# EAGLE design controller-rev1.1 (EAGLE 9.6.2)
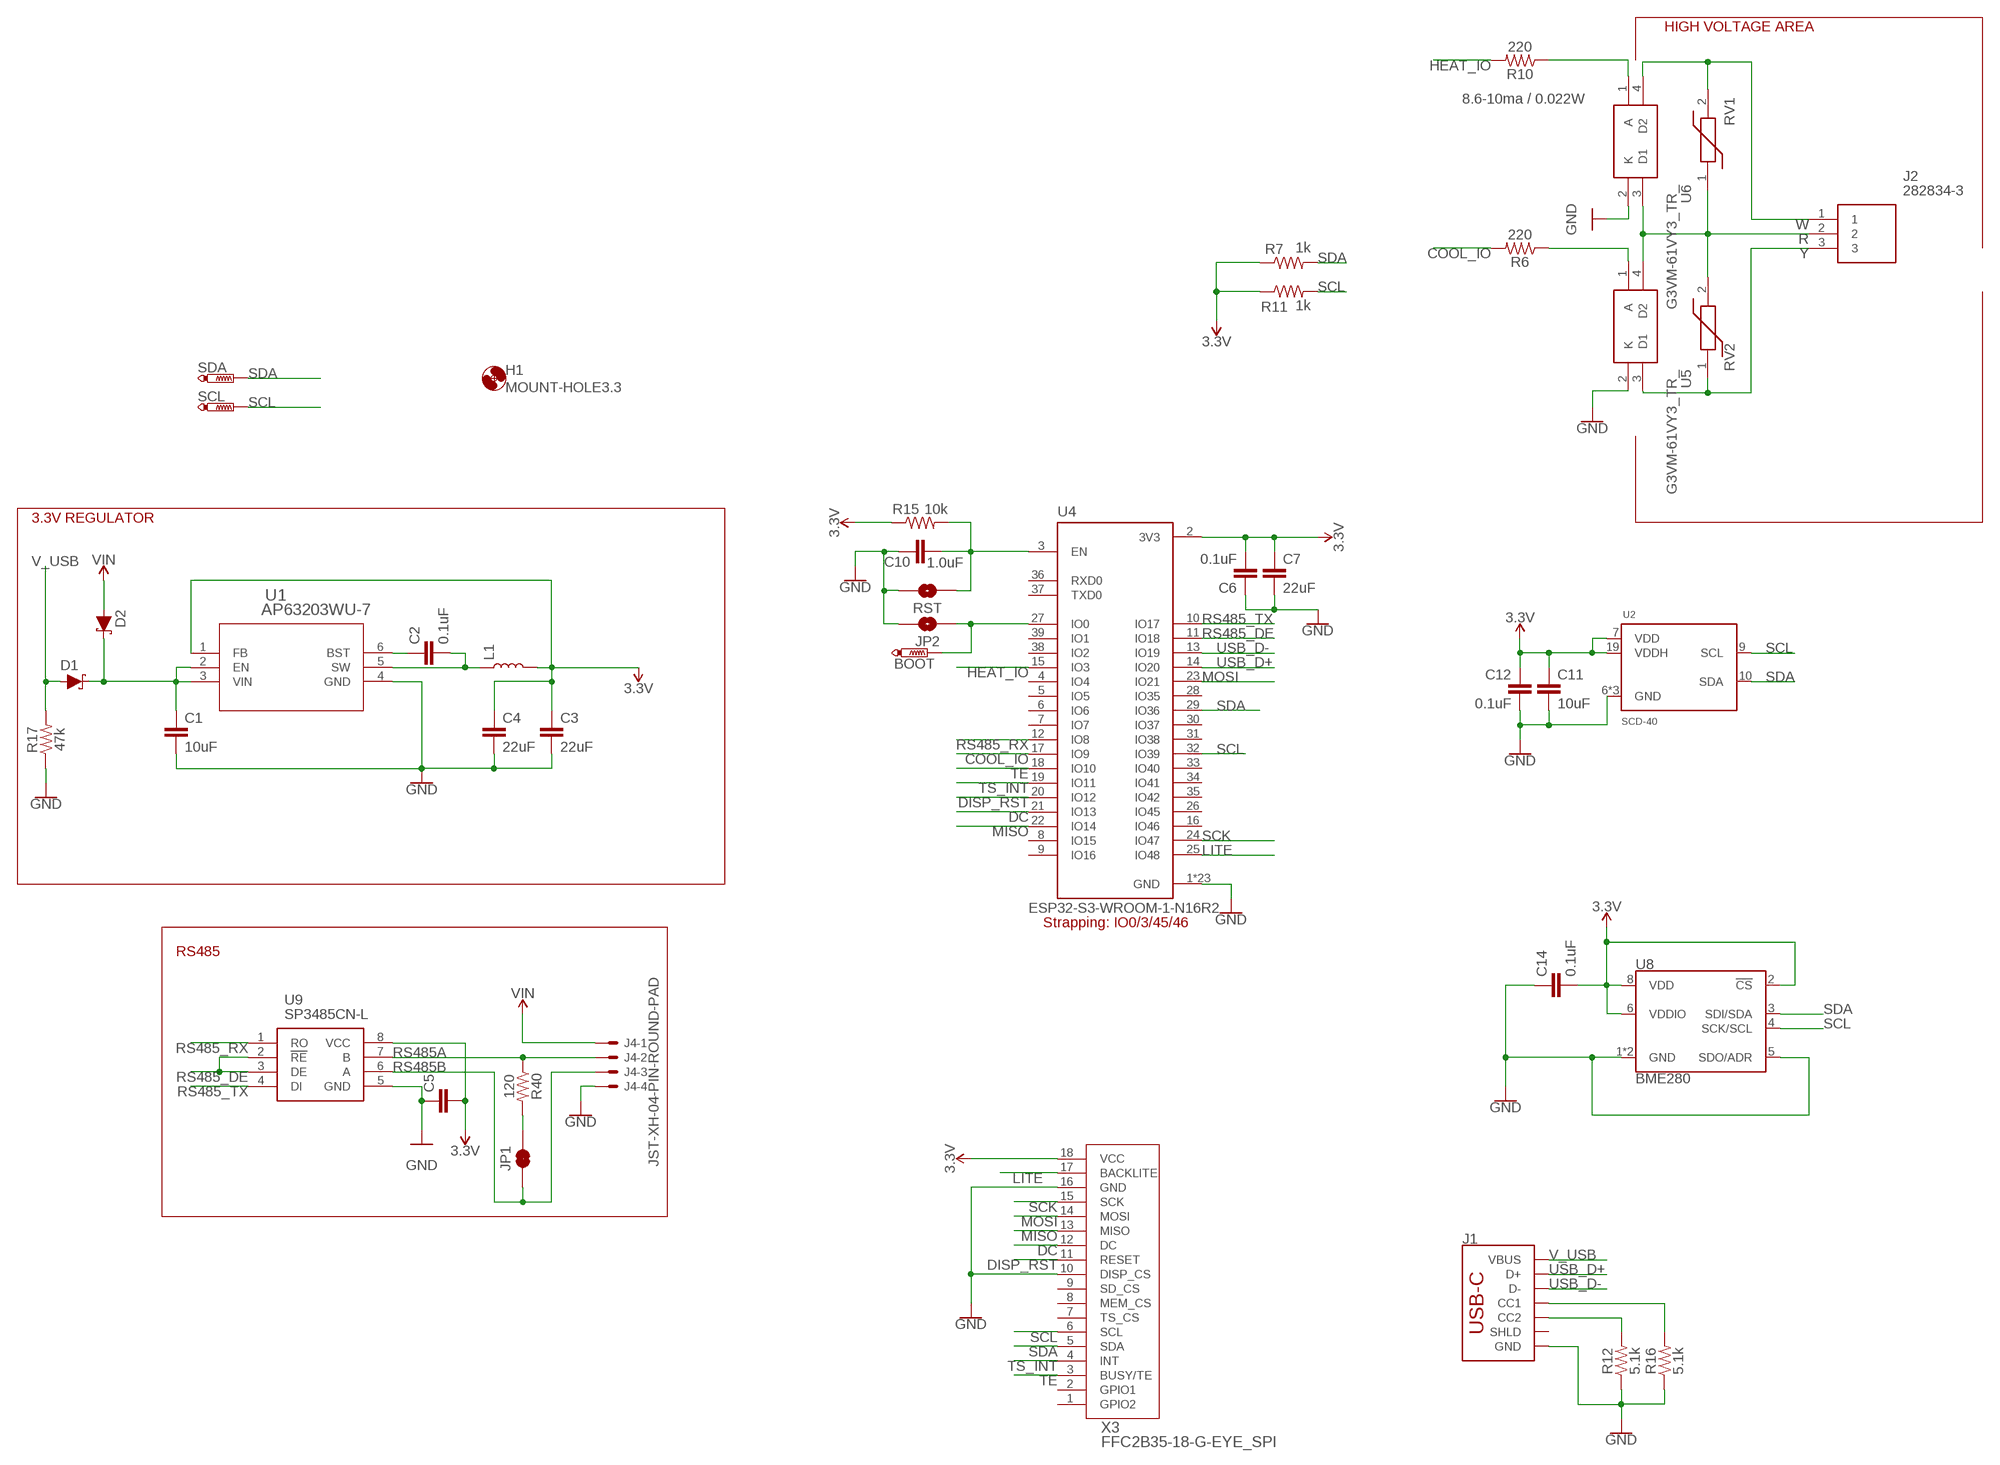
[diagram p0: schematic, sheet 1]

## Parts
BOOT  PTR1B1,27  [B1,27]
C1  10uF  10UF-1206-6.3V-20%  [1206]
C2  0.1uF  0.1UF-0603-25V-5%  [0603]
C3  22uF  22UF-0805-6.3V-20%  [0805]
C4  22uF  22UF-0805-6.3V-20%  [0805]
C5  0.1uF  0.1UF-0603-25V-5%  [0603]
C6  0.1uF  0.1UF-0603-25V-5%  [0603]
C7  22uF  22UF-0805-6.3V-20%  [0805]
C10  1.0uF  1.0UF-0603-16V-10%  [0603]
C11  10uF  10UF-1206-6.3V-20%  [1206]
C12  0.1uF  0.1UF-0603-25V-5%  [0603]
C14  0.1uF  0.1UF-0603-25V-5%  [0603]
D1  1A/23V/620mV  DIODE-SCHOTTKY-BAT20J  [SOD-323]
D2  1A/23V/620mV  DIODE-SCHOTTKY-BAT20J  [SOD-323]
H1  MOUNT-HOLE3.3  [3,3]
J1  USB_C_2-LAYER_PADS  [USB-C-16P-2LAYER-PADS]
J2  282834-3  [2828343]
J4  JST-XH-04-PIN-ROUND-PAD  [JST-XH-04-PACKAGE-ROUND-PAD]
JP1  JUMPER-SMT_2_NC_TRACE_NO-SILK  [SMT-JUMPER_2_NC_TRACE_NO-SILK]
JP2  JUMPER-SMT_2_NO_NO-SILK  [SMT-JUMPER_2_NO_NO-SILK]
L1  4.7μH_SHIELDED_INDUCTOR  [1008(2520)]
R6  220  220OHM-0603-1/10W-1%  [0603]
R7  1k  1KOHM-0603-1/10W-1%  [0603]
R10  220  220OHM-0603-1/10W-1%  [0603]
R11  1k  1KOHM-0603-1/10W-1%  [0603]
R12  5.1k  5.1KOHM5.1KOHM-0603-1/10W-1%  [0603]
R15  10k  10KOHM-0603-1/10W-1%  [0603]
R16  5.1k  5.1KOHM5.1KOHM-0603-1/10W-1%  [0603]
R17  47k  47KOHM-0603-1/10W-1%  [0603]
R40  120  120OHM-0603-1/10W-5%  [0603]
RST  JUMPER-SMT_2_NO_NO-SILK  [SMT-JUMPER_2_NO_NO-SILK]
RV1  ZV35K1210251NIR1  [VARC3225X145N]
RV2  ZV35K1210251NIR1  [VARC3225X145N]
SCL  PTR1B1,27  [B1,27]
SDA  PTR1B1,27  [B1,27]
U1  AP63203WU-7  [SOIC_05WU-7_DIO]
U2  SCD-40  [SCD40]
U4  ESP32-S3-WROOM-1-N16R2  [XCVR_ESP32-S3-WROOM-1-N16R2]
U5  G3VM-61VY3_TR_  [G3VM61VY3TR]
U6  G3VM-61VY3_TR_  [G3VM61VY3TR]
U8  BME280  [LGA-8-2.5X2.5]
U9  SP3485CN-L  [SOIC127P600X175-8N]
X3  FFC2B35-18-G-EYE_SPI  [FFC2B3518G]

## Nets
3.3V: C3.1 C4.1 C5.2 C6.2 C7.1 C11.1 C12.2 C14.2 L1.2 R7.1 R11.1 R15.1 U1.1(FB) U2.7(VDD) U2.19(VDDH) U4.2(3V3) U8.2(!CS) U8.6(VDDIO) U8.8(VDD) U9.8(VCC) X3.18(VCC)
COOL_IO: R6.2 U4.17(IO9)
DC: U4.21(IO13) X3.12(DC)
DISP_RST: U4.20(IO12) X3.11(RESET)
GND: C1.2 C3.2 C4.2 C5.1 C6.1 C7.2 C10.1 C11.2 C12.1 C14.1 J1.GND J1.GND2(GND) J4.4 JP2.2 R12.1 R16.1 R17.1 RST.2 U1.4(GND) U2.6(GND) U2.20(GND) U2.P$1(GND) U4.1(GND) U4.40(GND) U4.41_1(GND) U4.41_2(GND) U4.41_3(GND) U4.41_4(GND) U4.41_5(GND) U4.41_6(GND) U4.41_7(GND) U4.41_8(GND) U4.41_9(GND) U4.41_10(GND) U4.41_11(GND) U4.41_12(GND) U4.41_13(GND) U4.41_14(GND) U4.41_15(GND) U4.41_16(GND) U4.41_17(GND) U4.41_18(GND) U4.41_19(GND) U4.41_20(GND) U4.41_21(GND) U5.2(K) U6.2(K) U8.1(GND) U8.5(SDO/ADR) U8.7(GND) U9.5(GND) X3.10(DISP_CS) X3.16(GND)
HEAT_IO: R10.2 U4.15(IO3)
LITE: U4.25(IO48) X3.17(BACKLITE)
MISO: U4.22(IO14) X3.13(MISO)
MOSI: U4.23(IO21) X3.14(MOSI)
N$1: C2.2 L1.1 U1.5(SW)
N$2: C2.1 U1.6(BST)
N$3: BOOT.TP JP2.1 U4.27(IO0)
N$4: R6.1 U5.1(A)
N$5: JP1.2 R40.2
N$7: J1.A5(CC1) R16.2
N$9: C10.2 R15.2 RST.1 U4.3(EN)
N$10: R10.1 U6.1(A)
N$14: J1.B5(CC2) R12.2
R: J2.2 RV1.1 RV2.2 U5.4(D2) U6.3(D1)
REG_IN: C1.1 D1.C D2.C U1.2(EN) U1.3(VIN)
RS485_DE: U4.11(IO18) U9.2(!RE) U9.3(DE)
RS485_RX: U4.12(IO8) U9.1(RO)
RS485_TX: U4.10(IO17) U9.4(DI)
RS485A: J4.2 R40.1 U9.7(B)
RS485B: J4.3 JP1.1 U9.6(A)
SCK: U4.24(IO47) X3.15(SCK)
SCL: R11.2 SCL.TP U2.9(SCL) U4.32(IO39) U8.4(SCK/SCL) X3.6(SCL)
SDA: R7.2 SDA.TP U2.10(SDA) U4.29(IO36) U8.3(SDI/SDA) X3.5(SDA)
TE: U4.18(IO10) X3.3(BUSY/TE)
TS_INT: U4.19(IO11) X3.4(INT)
USB_D+: J1.A6(D+) J1.B6(D+) U4.14(IO20)
USB_D-: J1.A7(D-) J1.B7(D-) U4.13(IO19)
V_USB: D1.A J1.VBUS1(VBUS) J1.VBUS2(VBUS) R17.2
VIN: D2.A J4.1
W: J2.1 RV1.2 U6.4(D2)
Y: J2.3 RV2.1 U5.3(D1)
Unconnected: J1.SHLD1(SHLD) J1.SHLD2(SHLD) J1.SHLD3(SHLD) J1.SHLD4(SHLD) U4.4(IO4) U4.5(IO5) U4.6(IO6) U4.7(IO7) U4.8(IO15) U4.9(IO16) U4.16(IO46) U4.26(IO45) U4.28(IO35) U4.30(IO37) U4.31(IO38) U4.33(IO40) U4.34(IO41) U4.35(IO42) U4.36(RXD0) U4.37(TXD0) U4.38(IO2) U4.39(IO1) X3.1(GPIO2) X3.2(GPIO1) X3.7(TS_CS) X3.8(MEM_CS) X3.9(SD_CS)

## Notes on the sheet
- HIGH VOLTAGE AREA
- 8.6-10ma / 0.022W
- 3.3V REGULATOR
- Strapping: IO0/3/45/46
- RS485

## Library data of the parts
BOOT SCL SDA = testpad:PTR1: TEST PIN
C1 C11 = SparkFun-Capacitors:10UF: 10.0µF ceramic capacitors A capacitor is a passive two-terminal electrical component used to store electrical energy temporarily in an electric field.; PROD_ID: CAP-10057
C2 C5 C6 C12 C14 = SparkFun-Capacitors:0.1UF: 0.1µF ceramic capacitors A capacitor is a passive two-terminal electrical component used to store electrical energy temporarily in an electric field.; PROD_ID: CAP-08604
C3 C4 C7 = SparkFun-Capacitors:22UF: 22µF ceramic capacitors A capacitor is a passive two-terminal electrical component used to store electrical energy temporarily in an electric field.; PROD_ID: CAP-08402
C10 = SparkFun-Capacitors:1.0UF: 1µF ceramic capacitors A capacitor is a passive two-terminal electrical component used to store electrical energy temporarily in an electric field.; PROD_ID: CAP-00868
D1 D2 = SparkFun-DiscreteSemi:DIODE-SCHOTTKY: Schottky diode A Schottky diode is a semiconductor diode which has a low forward voltage drop and a very fast switching action.; PROD_ID: DIO-11623
H1 = holes:MOUNT-HOLE: MOUNTING HOLE with drill center marker
J1 = SparkFun-Connectors:USB_C: USB Type C 16Pin Connector Super Speed pins not available on the 16-pin purely SMD connector so this part is best for USB 2.0 implementations. D1 and D2 are tied together enabling D+/- no matter which way the cable is plugged into the connector. The two channel configuration pins (CC1/2) are exposed. These are normally connected to ground via 5.1k resistors but can be reconfigured for high current/high power applications. **4-LAYER BOARD WARNING!!** If designing 4-layer board, make sure to select the variant _4-LAYER-ISOLATED. The linked footprint (USB-C-16-4LAYER-ISOLATED) includes some very necessary cutout polygons in the inner layers (2 and 15). This prevents the PTH mounting shield legs on the USB connector from electrically connecting any other polygons on the inner layers (usually VCC and GND).; PROD_ID: CONN-14122
J2 = TE terminal block 282834-3:282834-3: Connector pcb 3 way 2.54mm Termi-Block Source: Datasheet <https://www.te.com/commerce/DocumentDelivery/DDEController?Action=showdoc&DocId=Customer Drawing282834C1pdfEnglishENG_CD_282834_C1.pdf282834-3>; DESCRIPTION: Connector pcb 3 way 2.54mm Termi-Block; HEIGHT: 10mm; MANUFACTURER_NAME: TE Connectivity; MANUFACTURER_PART_NUMBER: 282834-3; MOUSER_PART_NUMBER: 571-2828343; MOUSER_PRICE-STOCK: https://www.mouser.co.uk/ProductDetail/TE-Connectivity/282834-3?qs=A%252Bip%252BNCYi6M69kAjqV38yA%3D%3D
J4 = Rembrandt Electronics - JST XH Connectors v1-0:JST-XH-04-PIN: JST XH Connector 2 Pin Wire to board connector. Pitch: 2,54 mm, (0.100") Number of pins: 4 Created by Rembrandt Electronics www.rembrandtelectronics.com
JP1 = SparkFun-Jumpers:JUMPER-SMT_2_NC_TRACE: Normally closed trace jumper This jumper has a trace between two pads so it's normally closed (NC). Use a razor knife to open the connection. For best results follow the IPC guidelines for cutting traces: Cutout at least 0.063 mm (0.005 in). Remove all loose material to clean up the cut area. Seal the cut with an approved epoxy. Reapply solder to reclose the connection.
JP2 RST = SparkFun-Jumpers:JUMPER-SMT_2_NO: Normally open jumper This jumper has two pads in close proximity to each other. Apply solder to close the connection. Round pads are easier to solder for beginners, but are a lot larger. SparkFun Product that uses the round pads: SparkFun EL Sequencer <https://www.sparkfun.com/products/12781>
L1 = SparkFun-Coils:4.7μH_SHIELDED_INDUCTOR: 4.7uH Inductor 4.7uH 1.4A 50mOhm 1008(2520) Package Shielded; PROD_ID: NDUC-14880
R6 R10 = SparkFun-Resistors:220OHM: 220Ω resistor A resistor is a passive two-terminal electrical component that implements electrical resistance as a circuit element. Resistors act to reduce current flow, and, at the same time, act to lower voltage levels within circuits. - Wikipedia; PROD_ID: RES-07861
R7 R11 = SparkFun-Resistors:1KOHM: 1kΩ resistor A resistor is a passive two-terminal electrical component that implements electrical resistance as a circuit element. Resistors act to reduce current flow, and, at the same time, act to lower voltage levels within circuits. - Wikipedia; PROD_ID: RES-07856
R12 R16 = SparkFun-Resistors:5.1KOHM; PROD_ID: RES-12083
R15 = SparkFun-Resistors:10KOHM: 10kΩ resistor A resistor is a passive two-terminal electrical component that implements electrical resistance as a circuit element. Resistors act to reduce current flow, and, at the same time, act to lower voltage levels within circuits. - Wikipedia; PROD_ID: RES-00824
R17 = SparkFun-Resistors:47KOHM: 47kΩ resistor A resistor is a passive two-terminal electrical component that implements electrical resistance as a circuit element. Resistors act to reduce current flow, and, at the same time, act to lower voltage levels within circuits. - Wikipedia; PROD_ID: RES-07871
R40 = Resistors:120OHM
RV1 RV2 = Bourns Varistor ZV35K1210251NIR1:ZV35K1210251NIR1: Varistors ZV 35V 10% Source: Datasheet <https://g.componentsearchengine.com/Datasheets/2/ZV60K1210251NIR1HT.pdf>; DESCRIPTION: Varistors ZV 35V 10%; HEIGHT: 1.45mm; MANUFACTURER_NAME: Bourns; MANUFACTURER_PART_NUMBER: ZV35K1210251NIR1; MOUSER_PART_NUMBER: 652-ZV35K1210251NIR1; MOUSER_PRICE-STOCK: https://www.mouser.co.uk/ProductDetail/Bourns/ZV35K1210251NIR1?qs=GBLSl2AkirutxOaOmtSxyA%3D%3D
U1 = Diodes buck converter:AP63203WU-7; COPYRIGHT: Copyright (C) 2023 Ultra Librarian. All rights reserved.; MANUFACTURER_PART_NUMBER: AP63203WU-7; MFR_NAME: Diodes Inc
U2 = Adafruit SCD-41:SCD-40
U4 = ESP32-S3-WROOM-1-N16R2:ESP32-S3-WROOM-1-N16R2: Check availability <https://pricing.snapeda.com/parts/ESP32S3WROOM1N16R2/Espressif%20Systems/view-part?ref=eda>; AVAILABILITY: In Stock; CHECK_PRICES: https://www.snapeda.com/parts/ESP32S3WROOM1N16R2/Espressif+Systems/view-part/?ref=eda; DESCRIPTION: Bluetooth, WiFi 802.11b/g/n, Bluetooth v5.0 Transceiver Module 2.4GHz PCB Trace Surface Mount; MF: Espressif Systems; MP: ESP32S3WROOM1N16R2; PACKAGE: NON STANDARD Espressif Systems; PRICE: None; PURCHASE-URL: https://www.snapeda.com/api/url_track_click_mouser/?unipart_id=10874217&manufacturer=Espressif Systems&part_name=ESP32S3WROOM1N16R2&search_term=None; SNAPEDA_LINK: https://www.snapeda.com/parts/ESP32S3WROOM1N16R2/Espressif+Systems/view-part/?ref=snap
U5 U6 = Omron SSR G3VM-61VY3_TR_:G3VM-61VY3_TR_: Solid State Relays - PCB Mount MOSFET Relay SOP4 60V 700mA 1 Form A Source: Datasheet <https://www.arrow.com/en/products/g3vm-61vy3-tr/omron>; DESCRIPTION: Solid State Relays - PCB Mount MOSFET Relay SOP4 60V 700mA 1 Form A; HEIGHT: 2.5mm; MANUFACTURER_NAME: Omron Electronics; MANUFACTURER_PART_NUMBER: G3VM-61VY3(TR); MOUSER_PART_NUMBER: 653-G3VM-61VY3TR; MOUSER_PRICE-STOCK: https://www.mouser.co.uk/ProductDetail/Omron-Electronics/G3VM-61VY3TR?qs=F5EMLAvA7IDWDr%252BrEjvwmw%3D%3D
U8 = SparkFun-Sensors:BME280: Bosch BME280 – Combined Humidity and Pressure Sensor The BME280 is as combined digital humidity, pressure and temperature sensor based on proven sensing principles. The sensor module is housed in an extremely compact metal-lid LGA package with a footprint of only 2.5×2.5mm² with a height of 0.93mm. Its small dimensions and its low power consumption allow the implementation in battery driven devices such as handsets, GPS modules or watches. Datasheet <https://cdn.sparkfun.com/assets/learn_tutorials/4/1/9/BST-BME280_DS001-10.pdf> SparkFun Products SparkFun Atmospheric Sensor Breakout - BME280 <https://www.sparkfun.com/products/13676> (SEN-13676); PROD_ID: IC-13090
U9 = MaxLinear RS485 SP3485CN-L:SP3485CN-L: Transceiver RS-485 3.3V 10Mbps SOIC8 EXAR SP3485CN-L, Line Transceiver, RS-422, RS-485, 3.3 V, 8-Pin SOIC Source: Datasheet <https://componentsearchengine.com/Datasheets/1/SP3485CN-L.pdf>; DESCRIPTION: Transceiver RS-485 3.3V 10Mbps SOIC8 EXAR SP3485CN-L, Line Transceiver, RS-422, RS-485, 3.3 V, 8-Pin SOIC; HEIGHT: 1.75mm; MANUFACTURER_NAME: EXAR; MANUFACTURER_PART_NUMBER: SP3485CN-L; MOUSER_PART_NUMBER: 701-SP3485CN-L; MOUSER_PRICE-STOCK: https://www.mouser.com/Search/Refine.aspx?Keyword=701-SP3485CN-L
X3 = GCT FFC2B35-18-G:FFC2B35-18-G-EYE_SPI: FFC & FPC Connectors .5mm SideEntry Flat Flex Cbl Conn 18P Au Source: Datasheet; DESCRIPTION: FFC & FPC Connectors .5mm SideEntry Flat Flex Cbl Conn 18P Au; HEIGHT: 2.2mm; MANUFACTURER_NAME: GCT (GLOBAL CONNECTOR TECHNOLOGY); MANUFACTURER_PART_NUMBER: FFC2B35-18-G; MOUSER_PART_NUMBER: 640-FFC2B35-18-G; MOUSER_PRICE-STOCK: https://www.mouser.co.uk/ProductDetail/GCT/FFC2B35-18-G?qs=Li%252BoUPsLEntRHHb6c10PFg%3D%3D

## Board
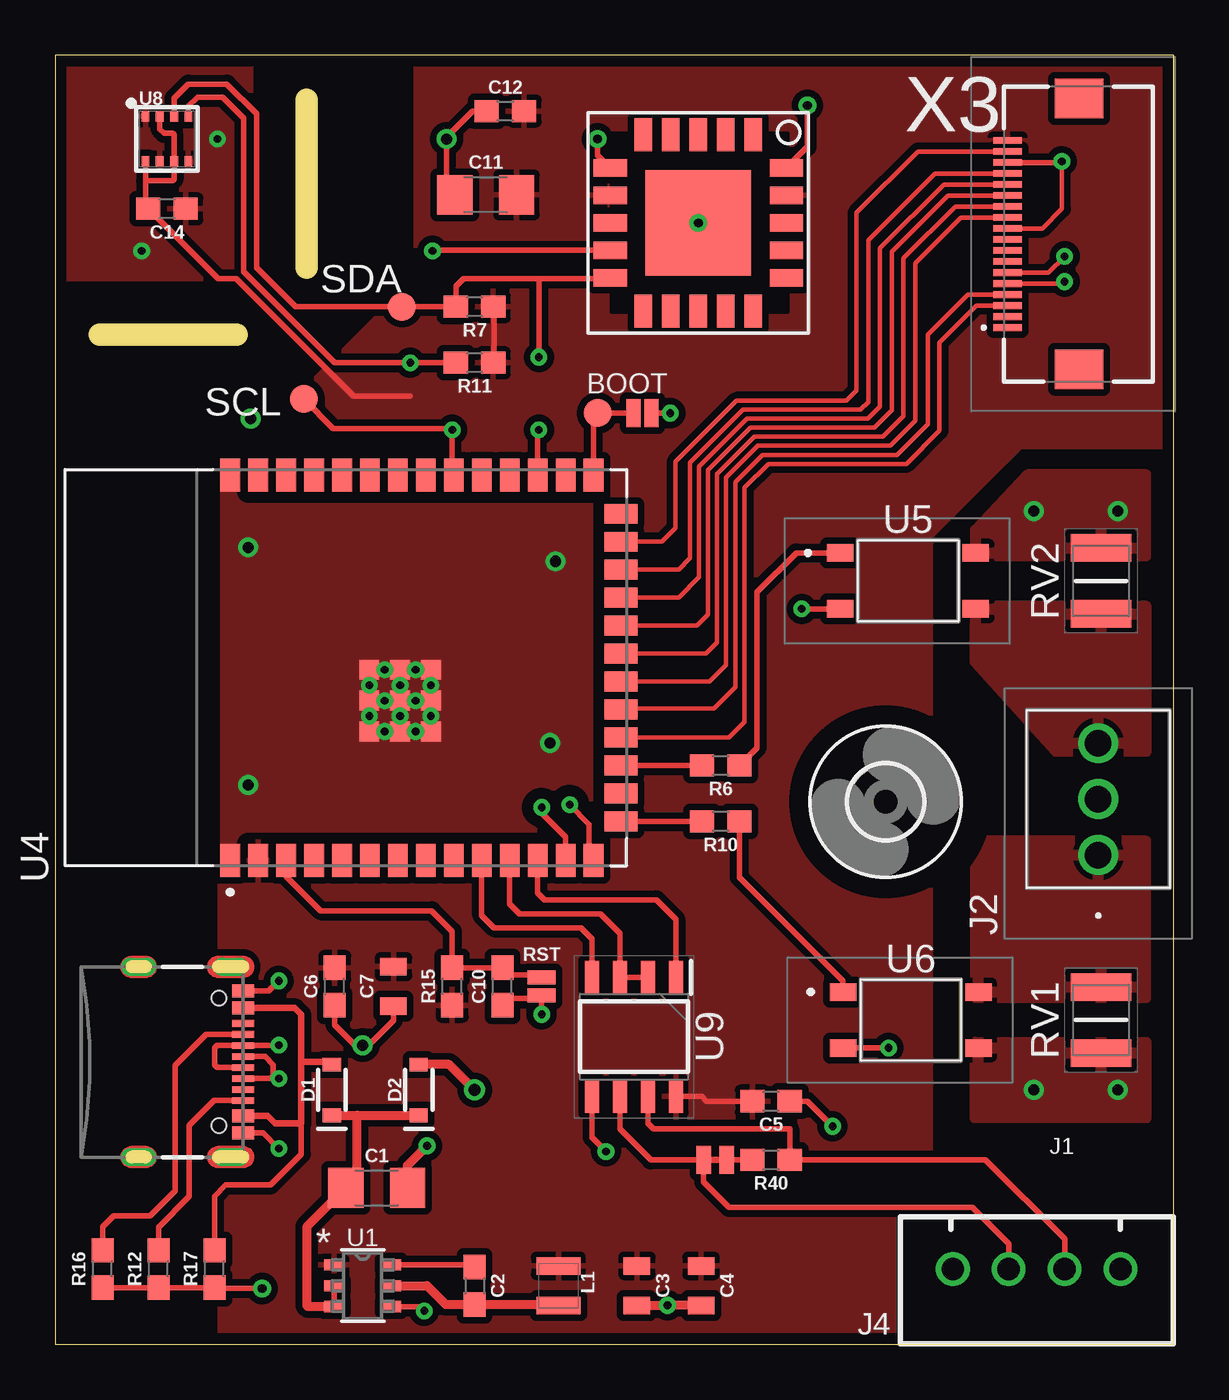
[diagram p1: board, top side]
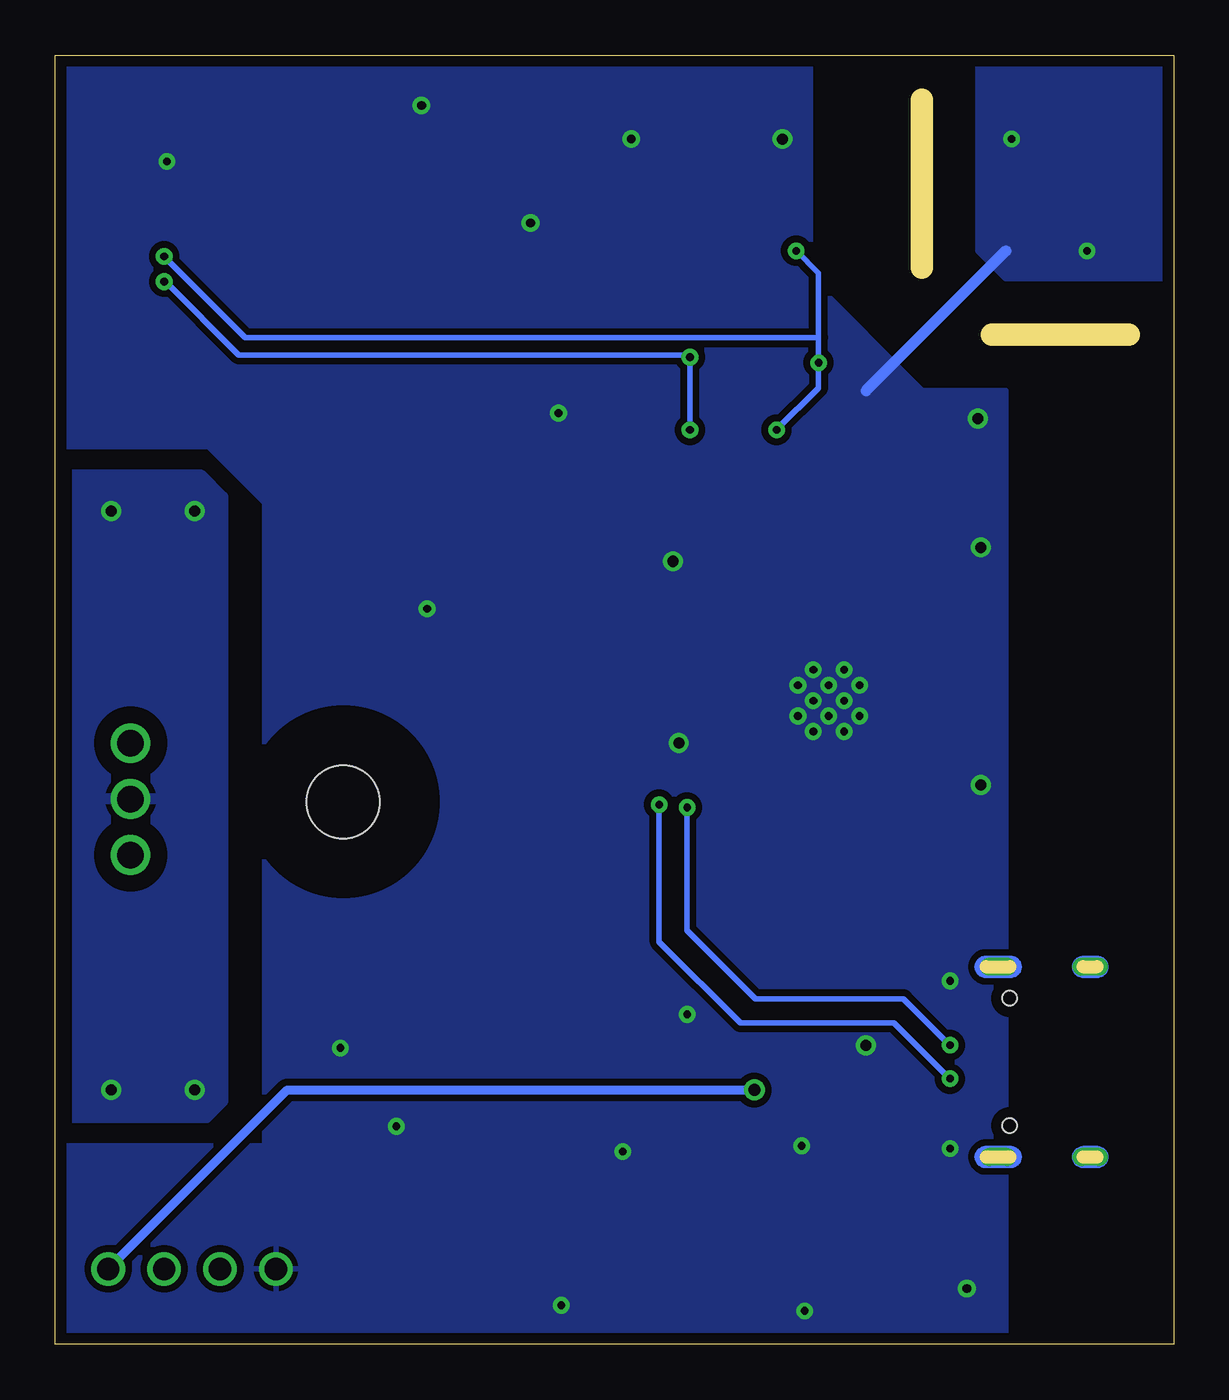
[diagram p2: board, bottom side, seen from below]

Size 50.8 x 58.55 mm. Coordinates in mm from the lower left corner, seen from the top.
Outline: 2.03,45.85 8.26,45.85
Outline: 11.43,56.52 11.43,48.9
Outline: 0,0 50.8,0 50.8,58.55 0,58.55 0,0
Copper layers (1*16): Top 0.035mm / dielectric 1.6mm / Bottom 0.035mm
Design rules "Elecrow_2-layer_PCB_eagle_rule_conservative": minimum track width 8mil, minimum drill 12mil, track to track 8mil, track to pad 6mil, pad to pad 6mil, via to via 8mil, smd to smd 0mil, copper to edge 20mil, drill to drill 10mil, minimum pad ring 8mil, minimum via ring 8mil, stop-mask expansion 0mil, vias tented up to drill 100mil, thermal gap 10mil
Milling: 2 lines

### Footprints (pad centres in the part's own frame; a part is rotated, then mirrored left to right if it is on the bottom)
B1,27 = smd 1.27 x 1.27: TP 0,0
1206 = smd 1.6 x 1.8: 1 -1.4,0; 2 1.4,0
0603 = smd 1.1 x 1: 1 -0.85,0; 2 0.85,0
0805 = smd 0.8 x 1.2: 1 -0.9,0; 2 0.9,0
SOD-323 = smd 0.63 x 0.83: A 1.15,0; C -1.15,0
3,3 = hole 3.3: 0,0
USB-C-16P-2LAYER-PADS = smd 0.3 x 1: A5 -1.25,-0.34; A6 -0.25,-0.34; A7 0.25,-0.34; A8 1.25,-0.34; B5 1.75,-0.34; B6 0.75,-0.34; B7 -0.75,-0.34; B8 -1.75,-0.34 | smd 0.6 x 1: GND -3.225,-0.34; GND2 3.225,-0.34; VBUS1 -2.45,-0.34; VBUS2 2.45,-0.34 | drill 0.4 pad 0.6 long: SHLD1 -4.318,-0.915; SHLD2 4.318,-0.915; SHLD3 -4.318,-5.095; SHLD4 4.318,-5.095 | hole 0.65: -2.89,-1.445; 2.89,-1.445
2828343 = drill 1.2 pad 1.8: 1 0,0; 2 2.54,0; 3 5.08,0
JST-XH-04-PACKAGE-ROUND-PAD = drill 1.016: 1 -3.81,0; 2 -1.27,0; 3 1.27,0; 4 3.81,0
SMT-JUMPER_2_NC_TRACE_NO-SILK = smd 0.66 x 1.27: 1 -0.521,0; 2 0.521,0
SMT-JUMPER_2_NO_NO-SILK = smd 0.635 x 1.27: 1 -0.406,0; 2 0.406,0
1008(2520) = smd 0.8 x 2: 1 -0.9,0; 2 0.9,0
VARC3225X145N = smd 1.25 x 2.75: 1 -1.5,0; 2 1.5,0
SOIC_05WU-7_DIO = smd 0.902 x 0.508: 1 -1.302,0.95; 2 -1.302,0; 3 -1.302,-0.95; 4 1.302,-0.95; 5 1.302,0; 6 1.302,0.95
SCD40 = smd 1.5 x 0.8: 1 -4,2.5; 2 -4,1.25; 3 -4,0; 4 -4,-1.25; 5 -4,-2.5; 11 4,-2.5; 12 4,-1.25; 13 4,0; 14 4,1.25; 15 4,2.5 | smd 0.8 x 1.5: 6 -2.5,-4; 7 -1.25,-4; 8 0,-4; 9 1.25,-4; 10 2.5,-4; 16 2.5,4; 17 1.25,4; 18 0,4; 19 -1.25,4; 20 -2.5,4 | smd 4.8 x 4.8: P$1 0,0
XCVR_ESP32-S3-WROOM-1-N16R2 = smd 1.5 x 0.9: 1 -8.75,5.26; 2 -8.75,3.99; 3 -8.75,2.72; 4 -8.75,1.45; 5 -8.75,0.18; 6 -8.75,-1.09; 7 -8.75,-2.36; 8 -8.75,-3.63; 9 -8.75,-4.9; 10 -8.75,-6.17; 11 -8.75,-7.44; 12 -8.75,-8.71; 13 -8.75,-9.98; 14 -8.75,-11.25; 27 8.75,-11.25; 28 8.75,-9.98; 29 8.75,-8.71; 30 8.75,-7.44; 31 8.75,-6.17; 32 8.75,-4.9; 33 8.75,-3.63; 34 8.75,-2.36; 35 8.75,-1.09; 36 8.75,0.18; 37 8.75,1.45; 38 8.75,2.72; 39 8.75,3.99; 40 8.75,5.26 | smd 0.9 x 1.5: 15 -6.985,-12.5; 16 -5.715,-12.5; 17 -4.445,-12.5; 18 -3.175,-12.5; 19 -1.905,-12.5; 20 -0.635,-12.5; 21 0.635,-12.5; 22 1.905,-12.5; 23 3.175,-12.5; 24 4.445,-12.5; 25 5.715,-12.5; 26 6.985,-12.5 | smd 0.9 x 0.9: 41_1 -1.5,-2.46; 41_2 -2.9,-2.46; 41_3 -0.1,-2.46; 41_4 -2.9,-3.86; 41_5 -1.5,-3.86; 41_6 -0.1,-3.86; 41_7 -2.9,-1.06; 41_8 -1.5,-1.06; 41_9 -0.1,-1.06 | drill 0.35 pad 0.61: 41_10 -1.5,-1.76; 41_11 -2.9,-1.76; 41_12 -0.1,-1.76; 41_13 -2.9,-3.16; 41_14 -1.5,-3.16; 41_15 -0.1,-3.16; 41_16 -2.2,-1.06; 41_17 -0.8,-1.06; 41_18 -2.2,-2.46; 41_19 -0.8,-2.46; 41_20 -2.2,-3.86; 41_21 -0.8,-3.86
G3VM61VY3TR = smd 0.8 x 1.2: 1 -1.27,-3.075; 2 1.27,-3.075; 3 1.27,3.075; 4 -1.27,3.075
LGA-8-2.5X2.5 = smd 0.35 x 0.5: 1 -0.975,1.025; 2 -0.325,1.025; 3 0.325,1.025; 4 0.975,1.025; 5 0.975,-1.025; 6 0.325,-1.025; 7 -0.325,-1.025; 8 -0.975,-1.025
SOIC127P600X175-8N = smd 1.5 x 0.65: 1 -2.7,1.905; 2 -2.7,0.635; 3 -2.7,-0.635; 4 -2.7,-1.905; 5 2.7,-1.905; 6 2.7,-0.635; 7 2.7,0.635; 8 2.7,1.905
FFC2B3518G = smd 0.3 x 1.3: 1 -4.25,1.198; 2 -3.75,1.198; 3 -3.25,1.198; 4 -2.75,1.198; 5 -2.25,1.198; 6 -1.75,1.198; 7 -1.25,1.198; 8 -0.75,1.198; 9 -0.25,1.198; 10 0.25,1.198; 11 0.75,1.198; 12 1.25,1.198; 13 1.75,1.198; 14 2.25,1.198; 15 2.75,1.198; 16 3.25,1.198; 17 3.75,1.198; 18 4.25,1.198 | smd 1.8 x 2.2: MP1 -6.15,-2.052; MP2 6.15,-2.052

### Placement (x,y rotation side)
BOOT  24.64,42.29 0 top
C1  14.61,7.11 0 top
C2  19.05,2.67 270 top
C3  26.42,2.67 270 top
C4  29.34,2.67 270 top
C5  32.51,11.05 180 top
C6  12.7,16.26 90 top
C7  15.37,16.26 270 top
C10  20.32,16.26 90 top
C11  19.56,52.2 180 top
C12  20.45,56.01 0 top
C14  5.08,51.56 180 top
D1  12.57,11.56 90 top
D2  16.51,11.56 90 top
H1  37.72,24.64 0 top
J1  8.89,12.83 270 top
J2  47.37,22.23 90 top
J4  44.58,3.43 180 top
JP1  29.97,8.38 0 top
JP2  26.67,42.29 0 top
L1  22.86,2.67 90 top
R6  30.23,26.29 180 top
R7  19.05,47.12 180 top
R10  30.23,23.75 180 top
R11  19.05,44.58 180 top
R12  4.7,3.43 90 top
R15  18.03,16.26 90 top
R16  2.16,3.43 90 top
R17  7.24,3.43 90 top
R40  32.51,8.38 180 top
RST  22.1,16.26 270 top
RV1  47.5,14.73 90 top
RV2  47.5,34.67 90 top
SCL  11.3,42.93 0 top
SDA  15.75,47.12 0 top
U1  13.97,2.67 0 top
U2  29.21,50.93 270 top
U4  13.21,30.73 90 top
U5  38.73,34.67 270 top
U6  38.86,14.73 270 top
U8  5.08,54.74 0 top
U9  26.29,13.97 270 top
X3  44.45,50.42 90 top

### Tracks (layer width: path | path; a pad name or v marks a point on that pad's centre or on a via)
3.3V
  Top 0.254: U8.8 4.11,52.83 | 4.11,52.83 4.11,51.69 C14.2 7.41,48.39 8.23,48.39 13.57,43.05 16.13,43.05 | 4.11,52.83 5.33,52.83 5.41,52.9 U8.6 5.41,54.92 5.33,54.99 4.95,54.99 4.75,55.19 U8.2 | R11.1 19.94,44.54 19.94,47.08 R7.1 | 29.34,3.81 C4.1 | C5.2 29.59,11.05 29.37,11.27 U9.8
  pour Top (isolate 0.305, rank 3): 39.75,6.22 38.1,6.24 38.1,0 7.62,0 7.49,0.13 7.49,43.43 11.43,43.43 16.38,48.39 16.38,58.55 50.8,58.55 50.8,40.77 43.81,40.77 39.75,36.7
  cutout Top: 25.27,54.99 33.27,54.99 33.27,46.86 25.27,46.86
COOL_IO
  Top 0.254: U4.17 R6.2
DC
  Top 0.203: U4.21 29.55,31.37 30.06,31.88 30.06,39.53 31.75,41.22 37.59,41.22 38.53,42.16 38.53,49.33 40.87,51.67 X3.12
DISP_RST
  Top 0.203: U4.20 29.72,30.1 30.47,30.85 30.47,39.36 31.92,40.82 37.93,40.82 39.06,41.95 39.06,49.1 41.14,51.17 X3.11
GND  (via drill 0.35, 0.4, 0.5)
  Top 0.203: X3.10 44.83,50.67 45.72,51.56 v45.72,53.72
  Top 0.254: X3.16 45.67,53.67 v45.72,53.72 | C11.2 17.78,52.22 v17.78,54.74 17.78,54.83 18.96,56.01 C12.1 | U2.6 24.64,54 v24.64,54.74 | U2.20 34.16,54.38 v34.16,56.26 | C7.2 15.37,14.72 14.23,13.59 v13.97,13.59 13.63,13.59 12.7,14.52 C6.1 | J1.GND 9.7,16.05 v10.16,16.51 | J1.GND2 9.45,9.6 v10.16,8.89 | R16.1 R12.1 R17.1 7.28,2.54 v9.4,2.54 | U1.4 16.57,1.72 v16.76,1.52 | U9.5 24.38,9.4 v25.02,8.76 | C5.1 34.16,11.05 v35.31,9.91 | U6.2 v37.85,13.46 | v33.91,33.4 U5.2 | JP2.2 v27.94,42.29 | C10.1 20.64,15.72 21.97,15.72 RST.2 v22.1,14.99
  Top 0.406: C4.2 27.82,1.77 | 27.82,1.77 v27.81,1.78 | C3.2 27.82,1.77 | C1.2 16,8.13 v16.89,9.02
  Bottom 0.508: 7.62,49.66 13.97,43.31
  other vias: 3.94,49.66 7.37,54.74 8.76,25.4 8.89,42.04 29.21,50.93 22.48,27.3 22.73,35.56 8.76,36.2
  pour Top (isolate 0.305): 0,58.55 8.89,58.55 8.89,49.53 7.75,48.39 0,48.39
  pour Bottom (isolate 0.305): 0,58.55 0,48.39 7.62,48.39 8.89,49.66 8.89,58.55
  pour Bottom (isolate 0.305, rank 2): 7.62,43.31 11.43,43.31 16.51,48.39 16.51,58.55 50.8,58.55 50.8,40.77 43.81,40.77 41.27,38.23 41.27,9.02 50.8,9.02 50.8,0.13 7.62,0.13
  pour Bottom (no thermals): 12.7,31.88 19.05,31.88 19.05,25.53 12.7,25.53
  pour Top (isolate 0.508, no thermals): 7.62,22.61 24.89,22.61 24.89,39.5 7.62,39.5
HEAT_IO
  Top 0.254: U4.15 R10.2
LITE
  Top 0.203: X3.17 39.18,54.17 36.4,51.38 36.4,43.31 35.94,42.85 30.95,42.85 28.18,40.08 28.18,37.07 27.56,36.45 U4.25
MISO
  Top 0.203: U4.22 29.15,32.64 29.65,33.15 29.65,39.7 31.59,41.63 37.21,41.63 38,42.42 38,49.62 40.55,52.17 X3.13
MOSI
  Top 0.203: X3.14 40.35,52.67 37.47,49.78 37.47,42.59 36.92,42.04 31.42,42.04 29.25,39.87 29.25,34.84 28.32,33.91 U4.23
N$1
  Top 0.406: U1.5 16.89,2.67 17.74,1.82 C2.2 22.81,1.82 L1.1
N$2
  Top 0.254: U1.6 18.95,3.62 C2.1
N$3
  Top 0.254: U4.27 24.46,42.11 BOOT.TP JP2.1
N$4
  Top 0.254: R6.1 31.88,27.09 31.88,34.16 33.66,35.94 U5.1
N$5
  Top 0.254: JP1.2 R40.2
N$7
  Top 0.254: J1.A5 6.86,14.08 5.46,12.68 5.46,6.99 4.32,5.84 2.67,5.84 2.16,5.33 R16.2
N$9
  Top 0.254: U4.3 10.49,21.26 12.06,19.68 17.11,19.68 18.03,18.76 R15.2 C10.2 20.64,16.79 21.97,16.79 RST.1
N$10
  Top 0.254: U6.1 35.79,16.5 31.08,21.21 R10.1
N$14
  Top 0.254: J1.B5 7.23,11.08 6.1,9.95 6.1,6.72 4.7,5.32 R12.2
R  (via drill 0.5)
  other vias: 44.45,37.85 48.26,37.85 44.45,11.56 48.26,11.56
  pour Bottom (isolate 0.762): 50.8,39.5 44.2,39.5 43.18,38.48 43.18,11.05 43.94,10.29 50.8,10.29
  pour Top (isolate 0.762): 41.78,13.72 49.53,13.72 49.53,10.29 41.78,10.29
  pour Top (isolate 0.762, rank 2): 41.78,35.81 49.53,35.81 49.53,39.5 44.17,39.5 41.78,36.96
REG_IN
  Top 0.254: U1.2 U1.3
  Top 0.406: U1.3 11.49,1.72 11.43,1.78 11.43,5.34 C1.1 13.72,7.62 13.72,10.41 | D1.C 13.72,10.41 | 13.72,10.41 D2.C
RS485_DE
  Top 0.254: U4.11 20.65,19.99 21.08,19.56 24.77,19.56 25.65,18.67 U9.3 U9.2
RS485_RX
  Top 0.254: U4.12 21.92,20.5 22.23,20.19 27.3,20.19 28.19,19.3 U9.1
RS485_TX
  Top 0.254: U4.10 19.38,19.48 19.94,18.92 23.88,18.92 24.38,18.41 U9.4
RS485A
  Top 0.254: U9.7 26.92,10.03 27.18,9.78 33.36,9.78 R40.1 42.25,8.38 45.85,4.79 J4.2
RS485B
  Top 0.254: U9.6 25.65,9.78 27.05,8.38 JP1.1 29.45,7.38 30.61,6.22 41.66,6.22 43.31,4.57 J4.3
SCK
  Top 0.203: X3.15 39.96,53.17 36.93,50.14 36.93,42.8 36.58,42.44 31.25,42.44 28.84,40.04 28.84,35.7 28.32,35.18 U4.24
SCL  (via drill 0.35)
  Top 0.203: X3.6 45.11,48.67 v45.85,49.4
  Top 0.254: U8.4 6.05,56.22 6.48,56.64 7.61,56.64 8.56,55.69 8.56,48.71 12.69,44.58 v16.13,44.58 R11.2 | SCL.TP 12.64,41.59 17.97,41.59 v18.03,41.53 18.03,39.56 U4.32 | v17.14,49.66 17.16,49.68 U2.9
  Bottom 0.254: v45.85,49.4 42.16,45.72 16.13,45.72 | 16.13,45.72 v16.13,44.58 16.13,43.43 v18.03,41.53 | 16.13,45.72 16.13,48.64 v17.14,49.66
SDA  (via drill 0.35)
  Top 0.203: X3.5 45.76,48.17 v45.85,48.26
  Top 0.254: U8.3 5.41,56.59 6.04,57.23 7.8,57.23 9.14,55.88 9.14,48.9 10.92,47.12 SDA.TP R7.2 18.2,48.05 18.54,48.39 21.97,48.39 | U2.10 25.17,48.39 21.97,48.39 | v21.97,44.83 21.97,48.39 | U4.29 21.92,41.48 v21.97,41.53
  Bottom 0.203: v21.97,44.83 21.97,44.93 | 45.79,48.26 v45.85,48.26
  Bottom 0.254: 21.97,44.93 42.46,44.93 45.79,48.26 | v21.97,41.53 v21.97,44.83
TE
  Top 0.203: X3.3 41.84,47.17 40.16,45.49 40.16,41.49 38.65,39.98 32.38,39.98 31.3,38.9 31.3,28.26 30.61,27.56 U4.18
TS_INT
  Top 0.203: X3.4 41.45,47.67 39.62,45.85 39.62,41.78 38.23,40.39 32.13,40.39 30.9,39.15 30.9,29.84 29.93,28.87 25.75,28.87 U4.19
USB_D+  (via drill 0.35)
  Top 0.254: J1.A6 9.53,13.08 9.91,12.7 9.91,12.19 9.79,12.08 J1.B6 10.15,12.08 v10.16,12.06 | U4.14 24.26,22.18 24.26,23.62 v23.37,24.51
  Bottom 0.254: v10.16,12.06 12.7,14.61 19.68,14.61 23.37,18.29 v23.37,24.51
USB_D-  (via drill 0.35)
  Top 0.254: J1.A7 7.36,12.58 7.24,12.7 7.24,13.46 7.35,13.58 J1.B7 10.15,13.58 v10.16,13.59 | v22.1,24.38 22.1,24.13 23.19,23.04 U4.13
  Bottom 0.254: v10.16,13.59 12.27,15.7 18.99,15.7 22.1,18.81 v22.1,24.38
V_USB
  Top 0.254: 9.95,10.08 9.99,10.03 | 11.18,10.03 11.18,8.64 9.78,7.24 7.75,7.24 7.24,6.73 R17.2
  Top 0.305: J1.VBUS2 9.65,10.38 9.95,10.08 | 11.18,12.83 12.45,12.83 D1.A | J1.VBUS1 10.88,15.28 11.18,14.99 11.18,12.83 | 11.18,12.83 11.18,10.03 9.99,10.03
VIN  (via drill 0.55)
  Top 0.406: v19.05,11.56 17.9,12.71 D2.A
  Bottom 0.406: J4.1 40.26,11.56 v19.05,11.56
W
  pour Top (isolate 0.762): 41.78,15.75 49.53,15.75 49.53,22.86 41.78,22.86
Y
  Top 0.254: RV2.1 46.59,33.17
  pour Top (isolate 0.762): 41.78,33.53 49.53,33.53 49.53,26.92 45.48,26.92 41.78,30.99